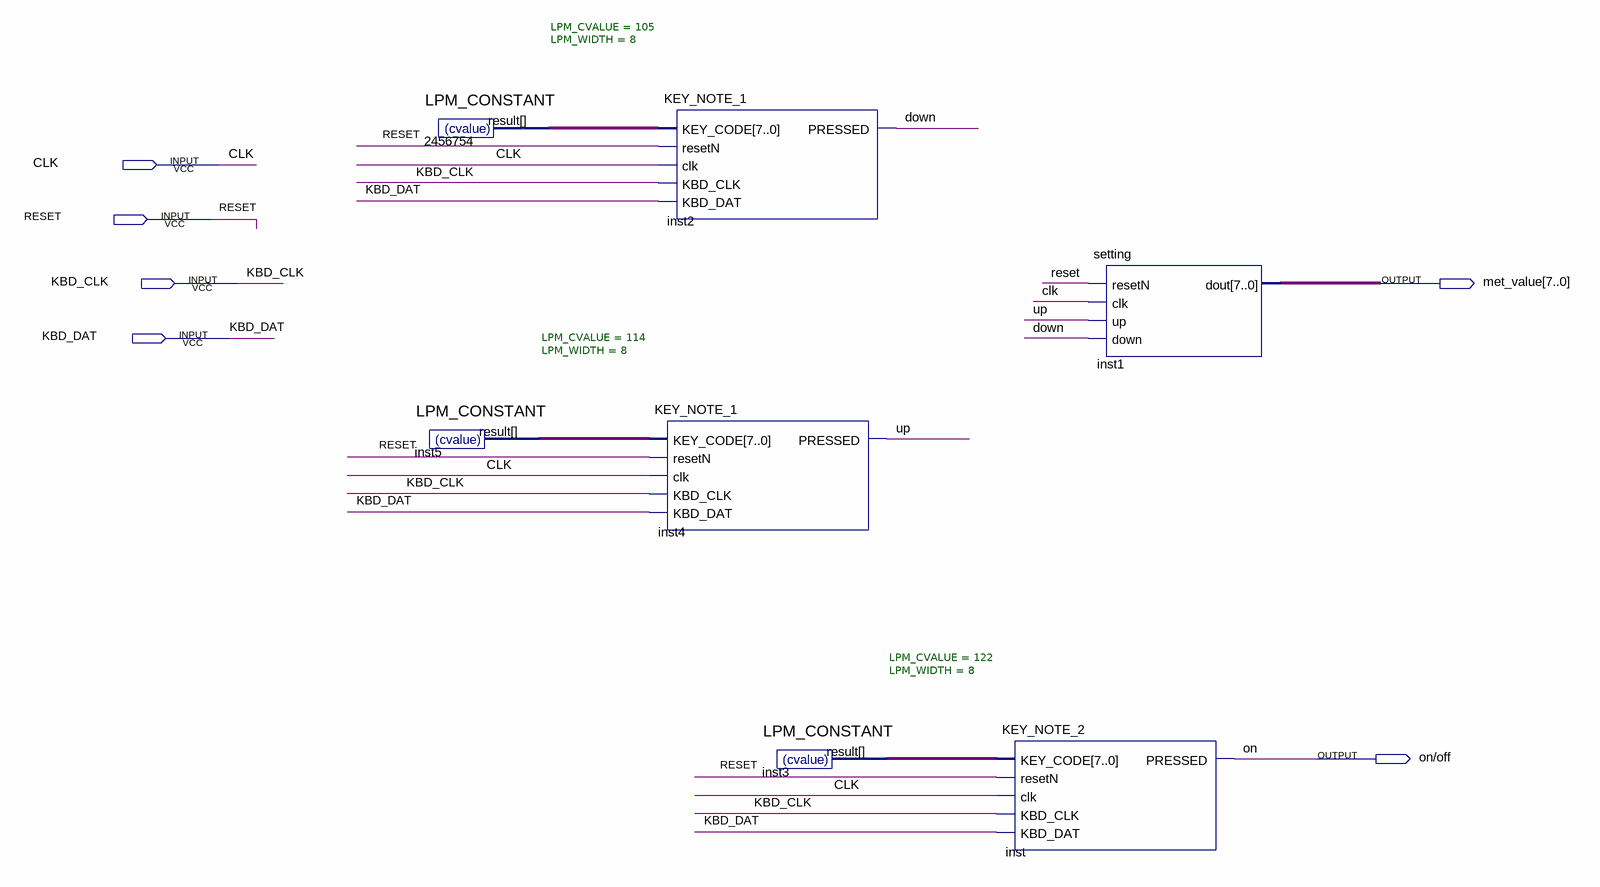
[diagram p0: schematic sheet]
// Quartus schematic KBD_MOD_met.bdf as structural Verilog: 7 symbols, 6 pins
module KBD_MOD_met (
  input  CLK,
  input  RESET,
  input  KBD_CLK,
  input  KBD_DAT,
  output [7:0] met_value,
  output \on/off 
);

  wire down, up;
  wire [7:0] inst3_result, inst5_result, n2456754_result;

  LPM_CONSTANT #(.LPM_CVALUE(105), .LPM_WIDTH(8)) u_2456754 (.result(n2456754_result));
  LPM_CONSTANT #(.LPM_CVALUE(114), .LPM_WIDTH(8)) inst5 (.result(inst5_result));
  KEY_NOTE_1 inst2 (
    .KEY_CODE(n2456754_result), .resetN(RESET), .clk(CLK), .KBD_CLK(KBD_CLK), .KBD_DAT(KBD_DAT),
    .PRESSED(down));
  KEY_NOTE_1 inst4 (
    .KEY_CODE(inst5_result), .resetN(RESET), .clk(CLK), .KBD_CLK(KBD_CLK), .KBD_DAT(KBD_DAT), .PRESSED(up));
  LPM_CONSTANT #(.LPM_CVALUE(122), .LPM_WIDTH(8)) inst3 (.result(inst3_result));
  KEY_NOTE_2 inst (
    .KEY_CODE(inst3_result), .resetN(RESET), .clk(CLK), .KBD_CLK(KBD_CLK), .KBD_DAT(KBD_DAT),
    .PRESSED(\on/off ));
  setting inst1 (.resetN(RESET), .clk(CLK), .up(up), .down(down), .dout(met_value));

  // Other names for the same wires on the sheet: on = \on/off 
endmodule
